# Altium project DoorControllerV2.PrjPCB
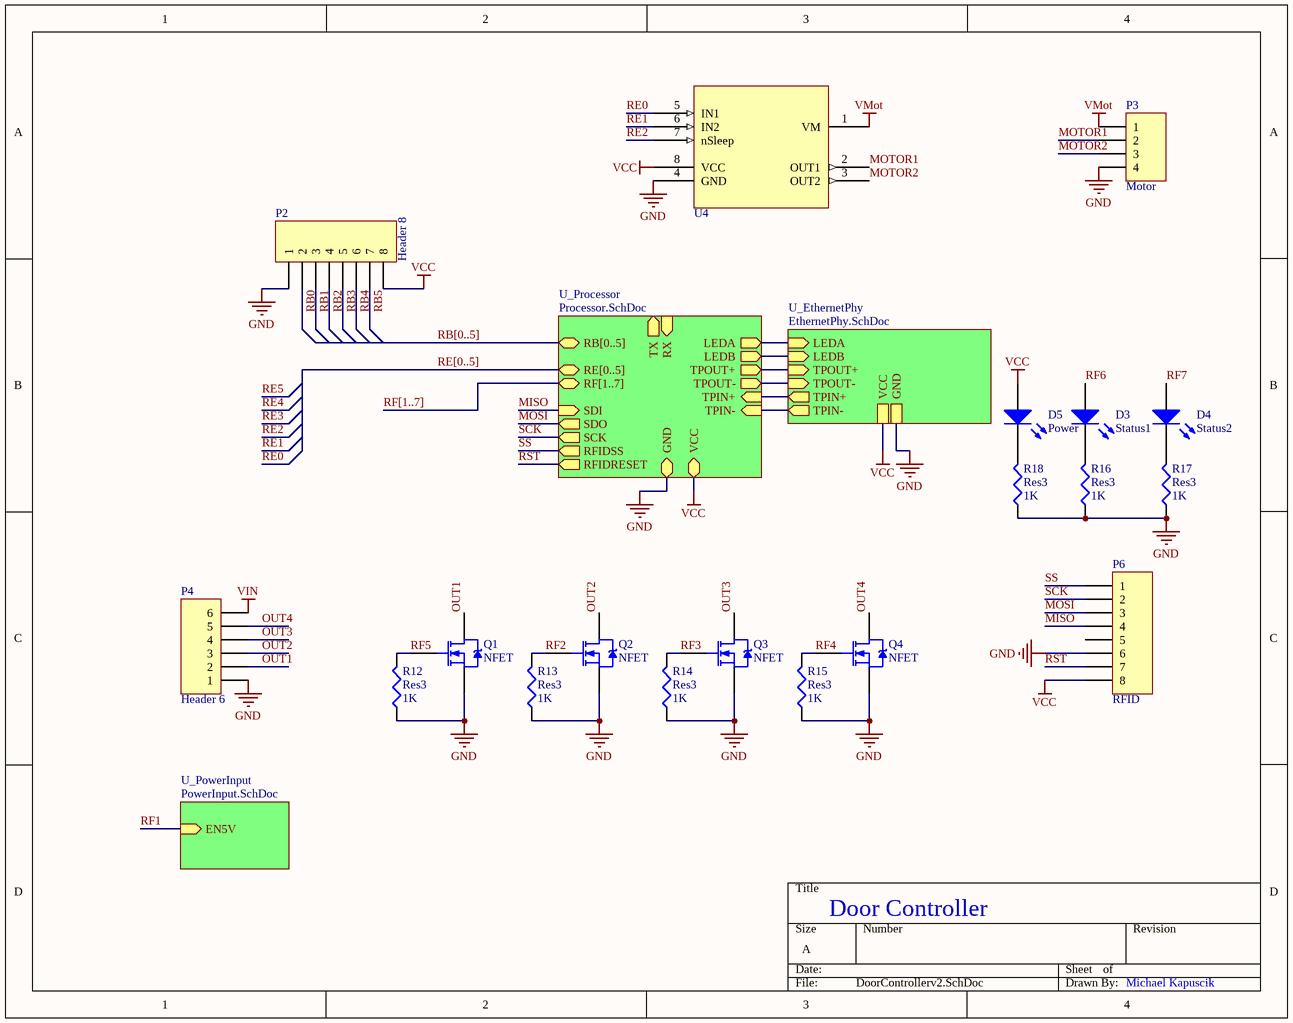
[diagram p0: DoorControllerv2.SchDoc]
5 sheets, 54 parts. Net scope: hierarchical (ports join the sheet entries above them; power ports are global).
Board files: doorcontrollerv2.PcbDoc, PCB1.PcbDoc
Sheets:
  DoorControllerv2.SchDoc
    U_Processor = Processor.SchDoc
    U_EthernetPhy = EthernetPhy.SchDoc
    U_PowerInput = PowerInput.SchDoc
      U_LiPoCharger = LiPoCharger.SchDoc

## Sheet DoorControllerv2.SchDoc
size A

### Parts
D3  Status1  [0603 LED]
D4  Status2  [0603 LED]
D5  Power  [0603 LED]
P2  Header 8  [HDR1X8]
P3  Motor  [HDR1X4]
P4  Header 6  [HDR1X6]
P6  RFID  [HDR1X8]
Q1  NFET  [SOT-23_M]
Q2  NFET  [SOT-23_M]
Q3  NFET  [SOT-23_M]
Q4  NFET  [SOT-23_M]
R12  Res3  value 1K  [J1-0603]
R13  Res3  value 1K  [J1-0603]
R14  Res3  value 1K  [J1-0603]
R15  Res3  value 1K  [J1-0603]
R16  Res3  value 1K  [J1-0603]
R17  Res3  value 1K  [J1-0603]
R18  Res3  value 1K  [J1-0603]
U4  1.8A H-Bridge  [S-PWSON-N8]  (value not drawn)

### Sub-sheets
U_EthernetPhy = EthernetPhy.SchDoc: LEDB (in), LEDA (in), TPIN+ (out), TPIN- (out), TPOUT+ (in), TPOUT- (in), VCC, GND
U_PowerInput = PowerInput.SchDoc: EN5V (in)
U_Processor = Processor.SchDoc: TPIN- (in), TPIN+ (in), TPOUT- (out), TPOUT+ (out), LEDA (out), LEDB (out), RB[0..5] (bidir), RE[0..5] (bidir), RF[1..7] (bidir), SCK (out), SDI (in), SDO (out), GND, VCC, TX (out), RX (in), RFIDSS (out), RFIDRESET (out)

### Nets
GND: P2.1 P3.4 P4.1 P6.6 Q1.2(S) Q2.2(S) Q3.2(S) Q4.2(S) R12.1 R13.1 R14.1 R15.1 R16.1 R17.1 R18.1 U4.4(GND) ; sheet U_Processor/GND, sheet U_EthernetPhy/GND
VCC: D5.1(A) P2.8 P6.8 U4.8(VCC) ; sheet U_Processor/VCC, sheet U_EthernetPhy/VCC
VIN: P4.6
VMot: P3.1 U4.1(VM)
MISO: P6.4 ; sheet U_Processor/SDI
MOSI: P6.3 ; sheet U_Processor/SDO
MOTOR1: P3.2 U4.2(OUT1)
MOTOR2: P3.3 U4.3(OUT2)
OUT1: P4.2 Q1.3(D)
OUT2: P4.3 Q2.3(D)
OUT3: P4.4 Q3.3(D)
OUT4: P4.5 Q4.3(D)
RB0: P2.2
RB1: P2.3
RB2: P2.4
RB3: P2.5
RB4: P2.6
RB5: P2.7
RE0: U4.5(IN1)
RE1: U4.6(IN2)
RE2: U4.7(nSleep)
RF2: Q2.1(G) R13.2
RF3: Q3.1(G) R14.2
RF4: Q4.1(G) R15.2
RF5: Q1.1(G) R12.2
RF6: D3.1(A)
RF7: D4.1(A)
RST: P6.7 ; sheet U_Processor/RFIDRESET
SCK: P6.2 ; sheet U_Processor/SCK
SS: P6.1 ; sheet U_Processor/RFIDSS
TPIN_N: sheet U_Processor/TPIN-, sheet U_EthernetPhy/TPIN-
TPIN_P: sheet U_Processor/TPIN+, sheet U_EthernetPhy/TPIN+
TPOUT_N: sheet U_Processor/TPOUT-, sheet U_EthernetPhy/TPOUT-
TPOUT_P: sheet U_Processor/TPOUT+, sheet U_EthernetPhy/TPOUT+
NetD3_2: D3.2(K) R16.2
NetD4_2: D4.2(K) R17.2
NetD5_2: D5.2(K) R18.2
NetE1_9: sheet U_Processor/LEDA, sheet U_EthernetPhy/LEDA
NetE1_12: sheet U_Processor/LEDB, sheet U_EthernetPhy/LEDB

Not connected (* = marked no-connect by the designer): P6 5

### Buses and harness runs
bus RB[0..5] = sheet U_Processor/RB[0..5]
bus RE[0..5] = sheet U_Processor/RE[0..5]
bus RF[1..7] = sheet U_Processor/RF[1..7]

### Notes on the sheet
- Door Controller
- Michael Kapuscik

### Library data of the parts
D3-D5 = LED0: Typical INFRARED GaAs LED; Published: 8-Jun-2000; LatestRevisionDate: 08-Jul-2005; LatestRevisionNote: Mech Layer 1 removed.; PackageReference: LED-0; Publisher: Altium Limited; PackageDescription: LED; 2 Leads
P2 P6 = Header 8: Header, 8-Pin; LatestRevisionDate: 17-Jul-2002; LatestRevisionNote: Re-released for DXP Platform.; Publisher: Altium Limited
P3 = Header 4: Header, 4-Pin; LatestRevisionDate: 17-Jul-2002; LatestRevisionNote: Re-released for DXP Platform.; Publisher: Altium Limited
P4 = Header 6: Header, 6-Pin; LatestRevisionDate: 17-Jul-2002; LatestRevisionNote: Re-released for DXP Platform.; Publisher: Altium Limited
Q1-Q4 = AO3418: 30V 3.4A N channel HEXFET
R12-R18 = Res3: Resistor; Published: 8-Jun-2000; LatestRevisionDate: 29-May-2009; LatestRevisionNote: IPC-7351 Footprint Added.; PackageReference: J1-0603; Publisher: Altium Limited; PackageDescription: Chip Resistor
U4 = DRV8837 H-Bridge: 1.8A H0bridge with integrated motor drive FETs; Supplier 1: Digi-Key; Supplier Part Number 1: 296-34806-1-ND

## Sheet Processor.SchDoc
size A
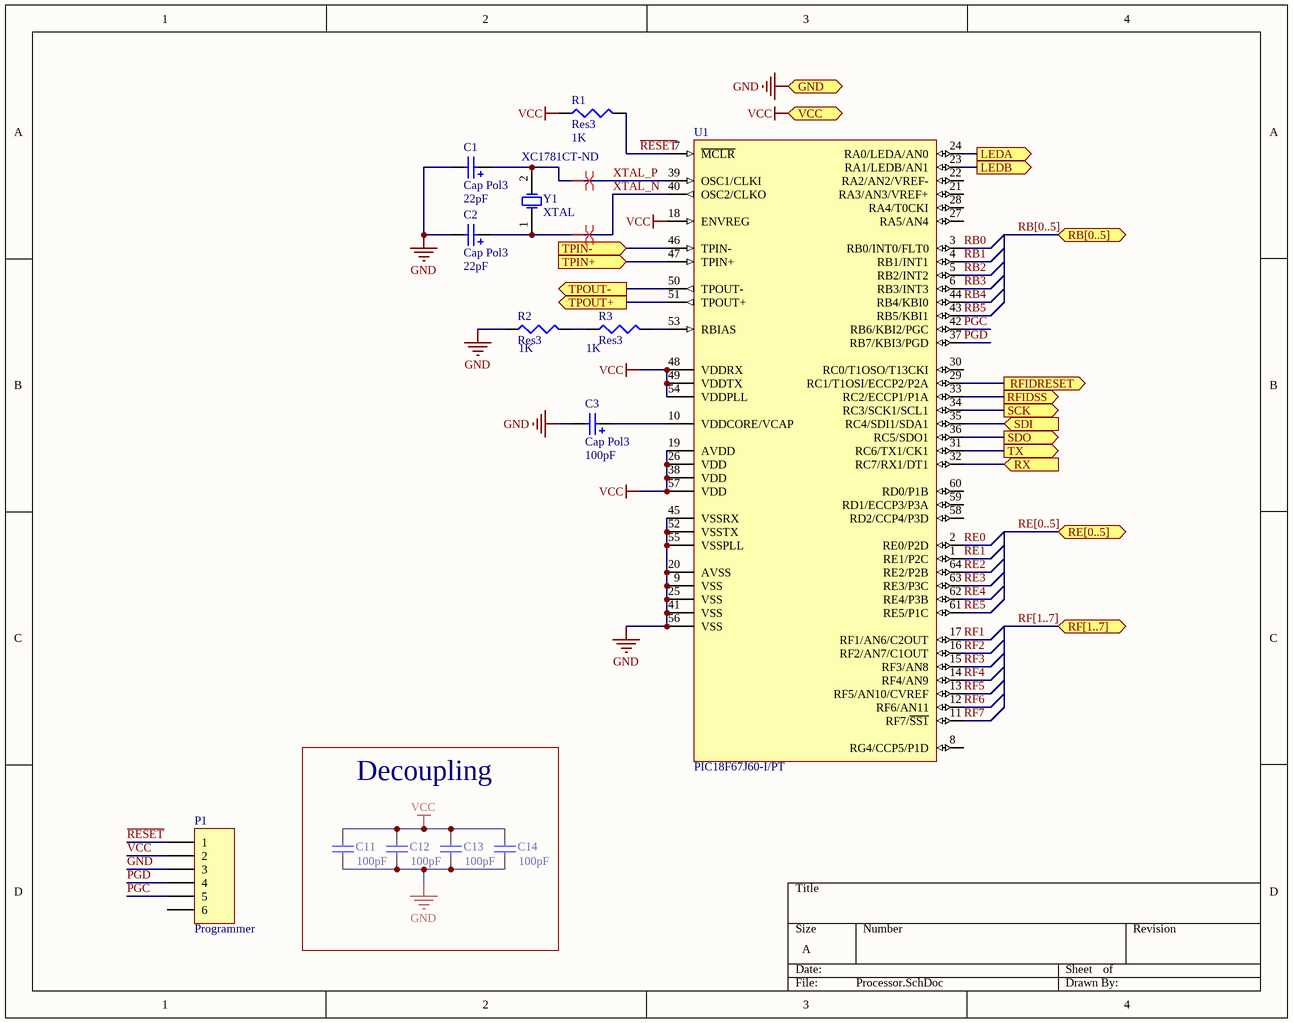
[diagram p1: Processor.SchDoc]

### Parts
C1  Cap Pol3  value 22pF  [C0805]
C2  Cap Pol3  value 22pF  [C0805]
C3  Cap Pol3  value 100pF  [C0805]
C11  value 100pF  [1608[0603]]  (hidden comment: Decoupling)
C12  value 100pF  [1608[0603]]  (hidden comment: Decoupling)
C13  value 100pF  [1608[0603]]  (hidden comment: Decoupling)
C14  value 100pF  [1608[0603]]  (hidden comment: Decoupling)
P1  Programmer  [HDR1X6]
R1  Res3  value 1K  [J1-0603]
R2  Res3  value 1K  [J1-0603]
R3  Res3  value 1K  [J1-0603]
U1  PIC18F67J60-I/PT  [TQFP-PT64_N]
Y1  XTAL  Supplier Part Number 1: XC1781CT-ND  [CSM-3X]

### Blocks framed on the sheet
Decoupling: C11-C14

### Ports
GND, LEDA (out), LEDB (out), RB[0..5] (bidir), RE[0..5] (bidir), RF[1..7] (bidir), RFIDRESET (out), RFIDSS (out), RX (in), SCK (out), SDI (in), SDO (out), TPIN+ (in), TPIN- (in), TPOUT+ (out), TPOUT- (out), TX (out), VCC

### Nets
GND: C1.2 C2.2 C3.2 C11.2 C12.2 C13.2 C14.2 P1.3 R2.1 U1.9(VSS) U1.20(AVSS) U1.25(VSS) U1.41(VSS) U1.45(VSSRX) U1.52(VSSTX) U1.55(VSSPLL) U1.56(VSS) ; port GND
VCC: C11.1 C12.1 C13.1 C14.1 P1.2 R1.1 U1.18(ENVREG) U1.19(AVDD) U1.26(VDD) U1.38(VDD) U1.48(VDDRX) U1.49(VDDTX) U1.54(VDDPLL) U1.57(VDD) ; port VCC
~{RESET}: P1.1 R1.2 U1.7(~{MCLR})
MISO: U1.35(RC4/SDI1/SDA1) ; port SDI
MOSI: U1.36(RC5/SDO1) ; port SDO
PGC: P1.5 U1.42(RB6/KBI2/PGC)
PGD: P1.4 U1.37(RB7/KBI3/PGD)
RB0: U1.3(RB0/INT0/FLT0)
RB1: U1.4(RB1/INT1)
RB2: U1.5(RB2/INT2)
RB3: U1.6(RB3/INT3)
RB4: U1.44(RB4/KBI0)
RB5: U1.43(RB5/KBI1)
RE0: U1.2(RE0/P2D)
RE1: U1.1(RE1/P2C)
RE2: U1.64(RE2/P2B)
RE3: U1.63(RE3/P3C)
RE4: U1.62(RE4/P3B)
RE5: U1.61(RE5/P1C)
RF1: U1.17(RF1/AN6/C2OUT)
RF2: U1.16(RF2/AN7/C1OUT)
RF3: U1.15(RF3/AN8)
RF4: U1.14(RF4/AN9)
RF5: U1.13(RF5/AN10/CVREF)
RF6: U1.12(RF6/AN11)
RF7: U1.11(RF7/~{SS1})
RST: U1.29(RC1/T1OSI/ECCP2/P2A) ; port RFIDRESET
SCK: U1.34(RC3/SCK1/SCL1) ; port SCK
SS: U1.33(RC2/ECCP1/P1A) ; port RFIDSS
TPIN_N: U1.46(TPIN-) ; port TPIN-
TPIN_P: U1.47(TPIN+) ; port TPIN+
TPOUT_N: U1.50(TPOUT-) ; port TPOUT-
TPOUT_P: U1.51(TPOUT+) ; port TPOUT+
XTAL_N: C2.1 U1.40(OSC2/CLKO) Y1.1(OSC1)
XTAL_P: C1.1 U1.39(OSC1/CLKI) Y1.2(OSC2)
NetC3_1: C3.1 U1.10(VDDCORE/VCAP)
NetE1_9: U1.24(RA0/LEDA/AN0) ; port LEDA
NetE1_12: U1.23(RA1/LEDB/AN1) ; port LEDB
NetR2_2: R2.2 R3.1
NetR3_2: R3.2 U1.53(RBIAS)
NetU1_31: U1.31(RC6/TX1/CK1) ; port TX
NetU1_32: U1.32(RC7/RX1/DT1) ; port RX

Not connected (* = marked no-connect by the designer): P1 6; U1 8(RG4/CCP5/P1D) 21(RA3/AN3/VREF+) 22(RA2/AN2/VREF-) 27(RA5/AN4) 28(RA4/T0CKI) 30(RC0/T1OSO/T13CKI) 58(RD2/CCP4/P3D) 59(RD1/ECCP3/P3A) 60(RD0/P1B)

### Buses and harness runs
bus RB[0..5] = port RB[0..5]
bus RE[0..5] = port RE[0..5]
bus RF[1..7] = port RF[1..7]

### Layout directives
differential pair: XTAL_N, XTAL_P

### Library data of the parts
C1-C3 = Cap Pol3: Polarized Capacitor (Surface Mount); Published: 8-Jun-2000; LatestRevisionDate: 29-May-2009; LatestRevisionNote: IPC-7351 Footprint Added.; PackageReference: C0805; Publisher: Altium Limited; PackageDescription: Chip Capacitor
C11-C14 = Cap Semi: Capacitor (Semiconductor SIM Model); Published: 8-Jun-2000; LatestRevisionDate: 29-May-2009; LatestRevisionNote: IPC-7351 Footprint Added.; PackageReference: C1206; Publisher: Altium Limited; PackageDescription: Chip Capacitor
P1 = Header 6: Header, 6-Pin; LatestRevisionDate: 17-Jul-2002; LatestRevisionNote: Re-released for DXP Platform.; Publisher: Altium Limited
R1-R3 = Res3: Resistor; Published: 8-Jun-2000; LatestRevisionDate: 29-May-2009; LatestRevisionNote: IPC-7351 Footprint Added.; PackageReference: J1-0603; Publisher: Altium Limited; PackageDescription: Chip Resistor
U1 = PIC18F67J60-I/PT: High Performance, 1-Mbit Flash Microcontroller with Ethernet, 128K Flash, 64-Pin TQFP, Industrial Temperature Range; Published: 29-Jan-2009; LatestRevisionDate: 02-Dec-2009; LatestRevisionNote: Updated to datasheet revision E, Oct-2009; DatasheetVersion: revE, Oct-2009; PackageVersion: revBB, Aug-2009; PackageReference: TQFP-PT64; Publisher: Altium Limited; PackageDescription: 64-Lead Thin Plastic Quad Flat Pack (PT) - 10x10x1mm Body, 2.00mm [TQFP]; Supplier 1: Digi-Key; Supplier Part Number 1: PIC18F67J60-I/PT-ND; Supplier 2: Farnell; Supplier Part Number 2: 1332285; Code_JEDEC: MS-026; ComponentLink1Description: Datasheet; ComponentLink1URL: http://ww1.microchip.com/downloads/en/DeviceDoc/39762e.pdf; ComponentLink2Description: Packaging Specification; ComponentLink2URL: http://www.microchip.com/stellent/groups/techpub_sg/documents/packagingspec/en012702.pdf; ComponentLink3Description: Microchip.com Home; ComponentLink3URL: http://www.microchip.com/
Y1 = XTAL: Crystal Oscillator; Published: 8-Jun-2000; LatestRevisionDate: 17-Jul-2002; LatestRevisionNote: Re-released for DXP Platform.; PackageReference: R38; Publisher: Altium Limited; PackageDescription: Crystal, Thru-Hole; 2 Leads; Body 3.1 x 8.2 mm (Dia.xH); Supplier 1: Digi-Key

## Sheet EthernetPhy.SchDoc
size A
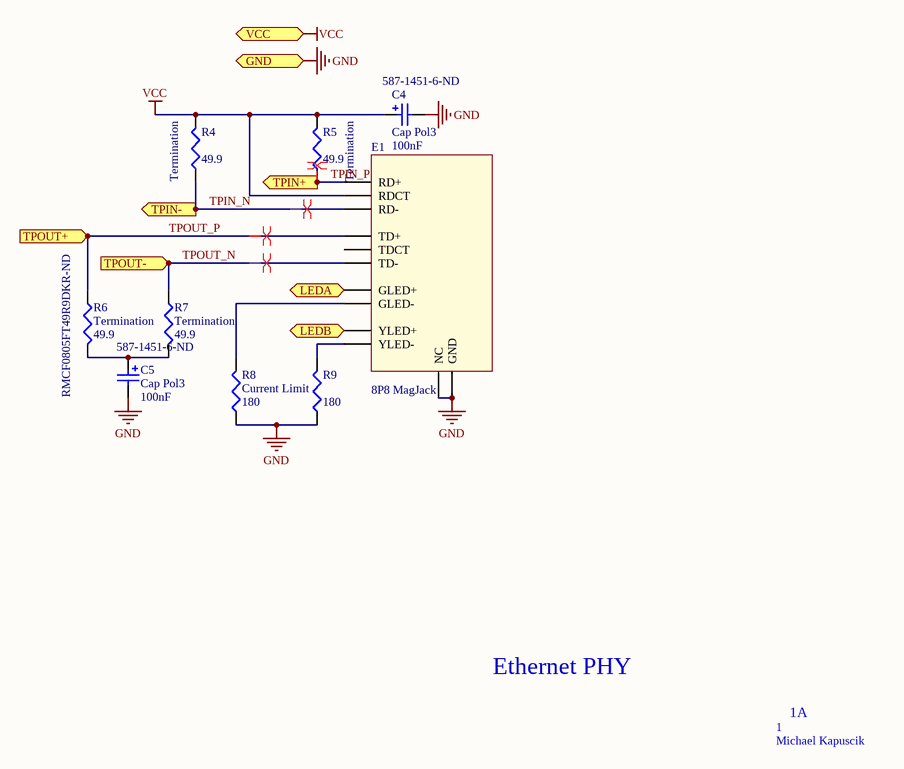
[diagram p2: EthernetPhy.SchDoc]

### Parts
C4  Cap Pol3  value 100nF  Supplier Part Number 1: 587-1451-6-ND  [C0805]
C5  Cap Pol3  value 100nF  Supplier Part Number 1: 587-1451-6-ND  [C0805]
E1  8P8 MagJack  [HR911105]
R4  Termination  value 49.9  [J1-0603]
R5  Termination  value 49.9  [J1-0603]
R6  Termination  value 49.9  Supplier Part Number 1: RMCF0805FT49R9DKR-ND  [J1-0603]
R7  Termination  value 49.9  [J1-0603]
R8  Current Limit  value 180  [J1-0603]
R9  value 180  [J1-0603]  (hidden comment: Current Limit)

### Ports
GND, LEDA (in), LEDB (in), TPIN+ (out), TPIN- (out), TPOUT+ (in), TPOUT- (in), VCC

### Nets
GND: C4.2 C5.2 E1.7(NC) E1.8(GND) R8.1 R9.1 ; port GND
VCC: C4.1 E1.5(RDCT) R4.2 R5.2 ; port VCC
TPIN_N: E1.6(RD-) R4.1 ; port TPIN-
TPIN_P: E1.3(RD+) R5.1 ; port TPIN+
TPOUT_N: E1.2(TD-) R7.1 ; port TPOUT-
TPOUT_P: E1.1(TD+) R6.1 ; port TPOUT+
NetC5_1: C5.1 R6.2 R7.2
NetE1_9: E1.9(GLED+) ; port LEDA
NetE1_10: E1.10(GLED-) R8.2
NetE1_11: E1.11(YLED-) R9.2
NetE1_12: E1.12(YLED+) ; port LEDB

Not connected (* = marked no-connect by the designer): E1 4(TDCT)

### Layout directives
differential pair: TPIN_N, TPIN_P, TPOUT_N, TPOUT_P

### Notes on the sheet
- Ethernet PHY
- 1
- 1A
- Michael Kapuscik

### Library data of the parts
C4 C5 = Cap Pol3: Polarized Capacitor (Surface Mount); Manufacturer: Taiyo Yuden; Manufacturer Part Number: EMK105B7104KV-F; Capacitance: 0.1µF; Voltage - Rated: 16V; Tolerance: ±10%; Temperature Coefficient: X7R; Published: 8-Jun-2000; LatestRevisionDate: 29-May-2009; LatestRevisionNote: IPC-7351 Footprint Added.; PackageReference: C0805; Publisher: Altium Limited; PackageDescription: Chip Capacitor; Supplier 1: Digi-Key; RoHS: RoHS Compliant; Category: Capacitors; Stock 1: 550127; Pricing 1: 1=0.1, 10=0.016, 50=0.0084, 100=0.0072, 250=0.00584, 500=0.005, 1000=0.0039, 5000=0.00325 (USD); Packaging: Digi-Reel®; Mounting Type: Surface Mount, MLCC; Operating Temperature: -55°C ~ 125°C; Applications: General Purpose; Ratings: -; Package / Case: 0402 (1005 Metric); Size / Dimension: 0.039" L x 0.020" W (1.00mm x 0.50mm); Height - Seated (Max): -; Thickness (Max): 0.022" (0.55mm); Lead Spacing: -; Features: -; Lead Style: -; ComponentLink1URL: http://www.yuden.co.jp/or/product/category/capacitor/EMK105B7104KV-F.pdf; ComponentLink1Description: http://www.yuden.co.jp/or/product/category/capacitor/EMK105B7104KV-F.pdf
R4-R9 = Res3: Resistor; Published: 8-Jun-2000; LatestRevisionDate: 29-May-2009; LatestRevisionNote: IPC-7351 Footprint Added.; PackageReference: J1-0603; Publisher: Altium Limited; PackageDescription: Chip Resistor
  R4-R7: Supplier 1: Digi-Key

## Sheet PowerInput.SchDoc
size A
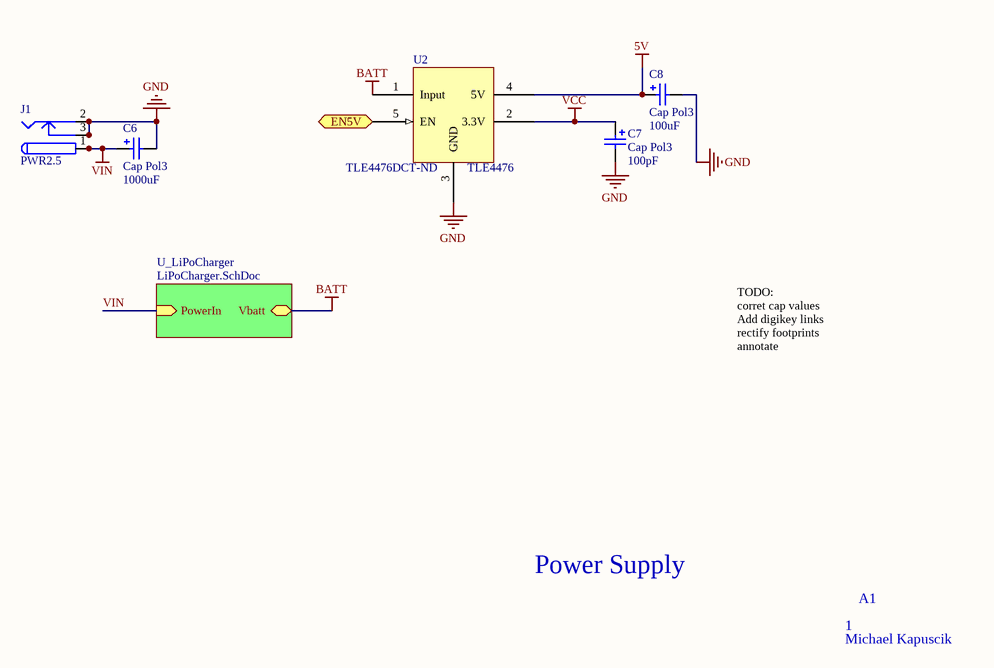
[diagram p3: PowerInput.SchDoc]

### Parts
C6  Cap Pol3  value 1000uF  [C2225]
C7  Cap Pol3  value 100pF  [C2225]
C8  Cap Pol3  value 100uF  [C2225]
J1  PWR2.5  [KLD-0202]
U2  TLE4476  Supplier Part Number 1: TLE4476DCT-ND  [P-TO252-5-1]

### Sub-sheets
U_LiPoCharger = LiPoCharger.SchDoc: Vbatt (bidir), PowerIn (in)

### Ports
EN5V (in)

### Nets
5V: C8.1 U2.4(5V)
BATT: U2.1(Input) ; sheet U_LiPoCharger/Vbatt
GND: C6.2 C7.2 C8.2 J1.2 J1.2A J1.2B J1.3 J1.3A J1.3B U2.3(GND)
VCC: C7.1 U2.2(3.3V)
VIN: C6.1 J1.1 J1.1A J1.1B ; sheet U_LiPoCharger/PowerIn
RF1: U2.5(EN) ; port EN5V

### Notes on the sheet
- TODO:
  corret cap values
  Add digikey links
  rectify footprints
  annotate
- Power Supply
- 1
- A1
- Michael Kapuscik

### Library data of the parts
C6-C8 = Cap Pol3: Polarized Capacitor (Surface Mount); Published: 8-Jun-2000; LatestRevisionDate: 29-May-2009; LatestRevisionNote: IPC-7351 Footprint Added.; PackageReference: C0805; Publisher: Altium Limited; PackageDescription: Chip Capacitor
J1 = PWR2.5: Low Voltage Power Supply Connector; Published: 17-Dec-2003; DatasheetDocument: 09-May-2002; Publisher: Altium Limited; ComponentLink1Description: Manufacturer Link; ComponentLink1URL: http://domino.kycon.com/internet/Products.html
U2 = TLE4476: Supplier 1: Digi-Key

## Sheet LiPoCharger.SchDoc
size A
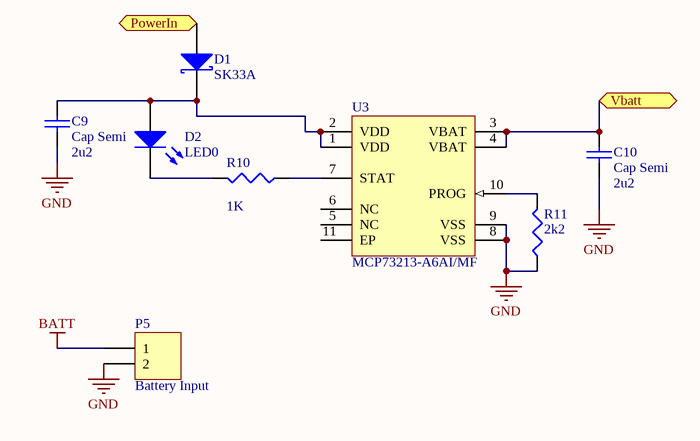
[diagram p4: LiPoCharger.SchDoc]

### Parts
C9  Cap Semi  value 2u2  [1608[0603]]
C10  Cap Semi  value 2u2  [1608[0603]]
D1  SK33A  [SMB]
D2  LED0  [0603 LED]
P5  Battery Input  [HDR1X2]
R10  value 1K  [J1-0603]  (hidden comment: Res3)
R11  value 2k2  [J1-0603]
U3  MCP73213-A6AI/MF  [DFN-MF10]

### Ports
PowerIn (in), Vbatt (bidir)

### Nets
BATT: C10.2 P5.1 U3.3(VBAT) U3.4(VBAT) ; port Vbatt
GND: C9.1 C10.1 P5.2 R11.1 U3.8(VSS) U3.9(VSS)
VIN: D1.1(A) ; port PowerIn
NetC9_2: C9.2 D1.2(K) D2.1(A) U3.1(VDD) U3.2(VDD)
NetD2_2: D2.2(K) R10.2
NetR10_1: R10.1 U3.7(STAT)
NetR11_2: R11.2 U3.10(PROG)

Not connected (* = marked no-connect by the designer): U3 5(NC) 6(NC) 11(EP)

### Library data of the parts
C9 C10 = Cap Semi: Capacitor (Semiconductor SIM Model); Published: 8-Jun-2000; LatestRevisionDate: 29-May-2009; LatestRevisionNote: IPC-7351 Footprint Added.; PackageReference: C1206; Publisher: Altium Limited; PackageDescription: Chip Capacitor
D1 = D Schottky: Schottky Diode; Published: 8-Jun-2000; LatestRevisionDate: 17-Jul-2002; LatestRevisionNote: Re-released for DXP Platform.; PackageReference: SMB; Publisher: Altium Limited; PackageDescription: DO-214-AA/SMB; 2 C-Bend Leads; Body 5.3 x 3.6 mm, inc. leads (LxW); Code_JEDEC: DO-214-AA
D2 = LED0: Typical INFRARED GaAs LED; Published: 8-Jun-2000; LatestRevisionDate: 08-Jul-2005; LatestRevisionNote: Mech Layer 1 removed.; PackageReference: LED-0; Publisher: Altium Limited; PackageDescription: LED; 2 Leads
P5 = Header 2: Header, 2-Pin; LatestRevisionDate: 17-Jul-2002; LatestRevisionNote: Re-released for DXP Platform.; Publisher: Altium Limited
R10 R11 = Res3: Resistor; Published: 8-Jun-2000; LatestRevisionDate: 29-May-2009; LatestRevisionNote: IPC-7351 Footprint Added.; PackageReference: J1-0603; Publisher: Altium Limited; PackageDescription: Chip Resistor
U3 = MCP73213-A6AI/MF: Dual-Cell Li-Ion / Li-Polymer Battery Charge Management Controller with OVP, 13V, 10-Pin DFN, Industrial Temperature; Published: 2-Dec-2009; DatasheetVersion: revA, Jul-2009; PackageVersion: revBB, Aug-2009; PackageReference: DFN-MF10; Publisher: Altium Limited; PackageDescription: 10-Lead Plastic Dual Flat, No Lead Package (MF) - 3x3x0.9mm Body [DFN]; ComponentLink1Description: Datasheet; ComponentLink1URL: http://ww1.microchip.com/downloads/en/DeviceDoc/22190a.pdf; ComponentLink2Description: Packaging Specification; ComponentLink2URL: http://www.microchip.com/stellent/groups/techpub_sg/documents/packagingspec/en012702.pdf; ComponentLink3Description: Microchip.com Home; ComponentLink3URL: http://www.microchip.com/

## Nets that join several sheets
BATT: PowerInput (U2.1), LiPoCharger (C10.2 P5.1 U3.3 U3.4)
GND: DoorControllerv2 (16 pins), Processor (17 pins), EthernetPhy (6 pins), PowerInput (10 pins), LiPoCharger (6 pins)
VCC: DoorControllerv2 (D5.1 P2.8 P6.8 U4.8), Processor (14 pins), EthernetPhy (C4.1 E1.5 R4.2 R5.2), PowerInput (C7.1 U2.2)
VIN: DoorControllerv2 (P4.6), PowerInput (C6.1 J1.1 J1.1A J1.1B), LiPoCharger (D1.1)
MISO: DoorControllerv2 (P6.4), Processor (U1.35)
MOSI: DoorControllerv2 (P6.3), Processor (U1.36)
NetE1_9: Processor (U1.24), EthernetPhy (E1.9)
NetE1_12: Processor (U1.23), EthernetPhy (E1.12)
RB0: DoorControllerv2 (P2.2), Processor (U1.3)
RB1: DoorControllerv2 (P2.3), Processor (U1.4)
RB2: DoorControllerv2 (P2.4), Processor (U1.5)
RB3: DoorControllerv2 (P2.5), Processor (U1.6)
RB4: DoorControllerv2 (P2.6), Processor (U1.44)
RB5: DoorControllerv2 (P2.7), Processor (U1.43)
RE0: DoorControllerv2 (U4.5), Processor (U1.2)
RE1: DoorControllerv2 (U4.6), Processor (U1.1)
RE2: DoorControllerv2 (U4.7), Processor (U1.64)
RF1: Processor (U1.17), PowerInput (U2.5)
RF2: DoorControllerv2 (Q2.1 R13.2), Processor (U1.16)
RF3: DoorControllerv2 (Q3.1 R14.2), Processor (U1.15)
RF4: DoorControllerv2 (Q4.1 R15.2), Processor (U1.14)
RF5: DoorControllerv2 (Q1.1 R12.2), Processor (U1.13)
RF6: DoorControllerv2 (D3.1), Processor (U1.12)
RF7: DoorControllerv2 (D4.1), Processor (U1.11)
RST: DoorControllerv2 (P6.7), Processor (U1.29)
SCK: DoorControllerv2 (P6.2), Processor (U1.34)
SS: DoorControllerv2 (P6.1), Processor (U1.33)
TPIN_N: Processor (U1.46), EthernetPhy (E1.6 R4.1)
TPIN_P: Processor (U1.47), EthernetPhy (E1.3 R5.1)
TPOUT_N: Processor (U1.50), EthernetPhy (E1.2 R7.1)
TPOUT_P: Processor (U1.51), EthernetPhy (E1.1 R6.1)